# Altium schematic sheet 02 INPUT_PWR_2.SchDoc
size 420 x 297 mm; Address1: Address1; Address2: Address2; Address3: Address3; Address4: Address4; DocumentNumber: АБВГ.123456.001 Э3; SheetNumber: 2; SheetTotal: 23; Scale: 1:1; DocumentType: Схема электрическая принципиальная; FirstReferrence: АБВГ.123456.001
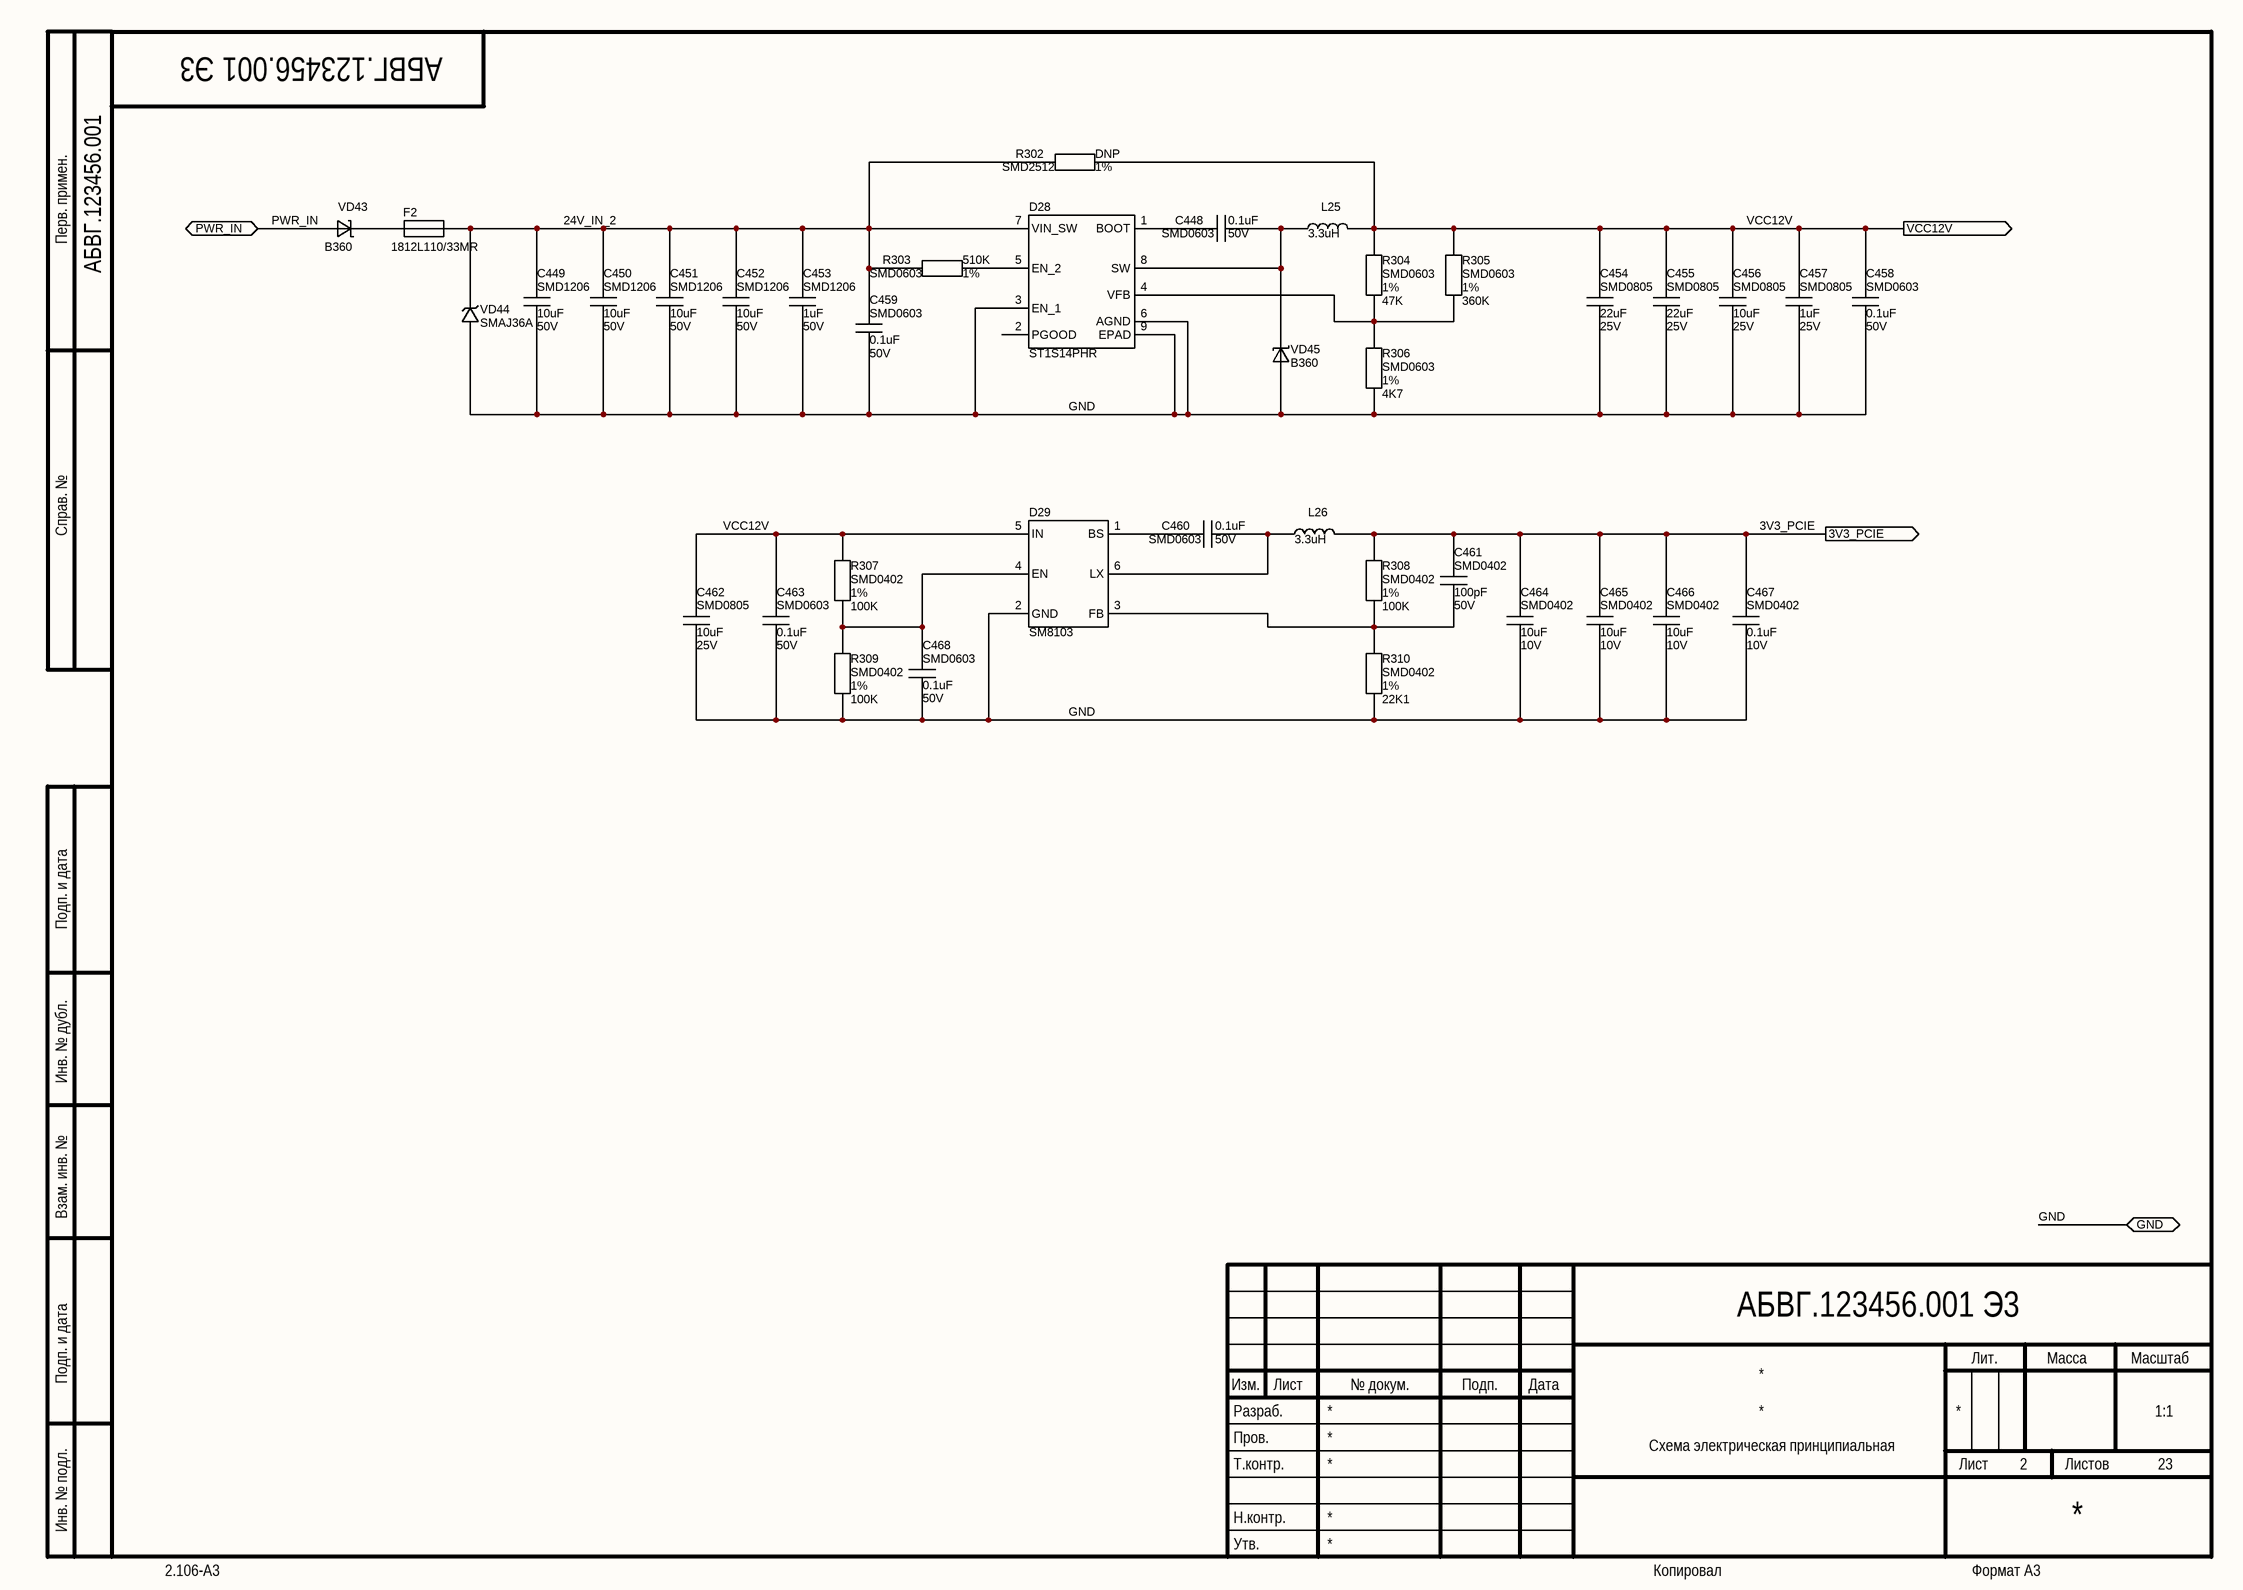
[diagram p0: 02 INPUT_PWR_2.SchDoc]

## Parts
C448  Package: SMD0603  Voltage: 50V  [CAP_SMD_0603]  (hidden comment: 0.1uF)
C449  Package: SMD1206  Voltage: 50V  [CAP_SMD_1206]  (hidden comment: 10uF)
C450  Package: SMD1206  Voltage: 50V  [CAP_SMD_1206]  (hidden comment: 10uF)
C451  Package: SMD1206  Voltage: 50V  [CAP_SMD_1206]  (hidden comment: 10uF)
C452  Package: SMD1206  Voltage: 50V  [CAP_SMD_1206]  (hidden comment: 10uF)
C453  Package: SMD1206  Voltage: 50V  [CAP_SMD_1206]  (hidden comment: 1uF)
C454  Package: SMD0805  Voltage: 25V  [CAP_SMD_0805]  (hidden comment: 22uF)
C455  Package: SMD0805  Voltage: 25V  [CAP_SMD_0805]  (hidden comment: 22uF)
C456  Package: SMD0805  Voltage: 25V  [CAP_SMD_0805]  (hidden comment: 10uF)
C457  Package: SMD0805  Voltage: 25V  [CAP_SMD_0805]  (hidden comment: 1uF)
C458  Package: SMD0603  Voltage: 50V  [CAP_SMD_0603]  (hidden comment: 0.1uF)
C459  Package: SMD0603  Voltage: 50V  [CAP_SMD_0603]  (hidden comment: 0.1uF)
C460  Package: SMD0603  Voltage: 50V  [CAP_SMD_0603]  (hidden comment: 0.1uF)
C461  Package: SMD0402  Voltage: 50V  [CAP_SMD_0402]  (hidden comment: 100pF)
C462  Package: SMD0805  Voltage: 25V  [CAP_SMD_0805]  (hidden comment: 10uF)
C463  Package: SMD0603  Voltage: 50V  [CAP_SMD_0603]  (hidden comment: 0.1uF)
C464  Package: SMD0402  Voltage: 10V  [CAP_SMD_0402]  (hidden comment: 10uF)
C465  Package: SMD0402  Voltage: 10V  [CAP_SMD_0402]  (hidden comment: 10uF)
C466  Package: SMD0402  Voltage: 10V  [CAP_SMD_0402]  (hidden comment: 10uF)
C467  Package: SMD0402  Voltage: 10V  [CAP_SMD_0402]  (hidden comment: 0.1uF)
C468  Package: SMD0603  Voltage: 50V  [CAP_SMD_0603]  (hidden comment: 0.1uF)
D28  ST1S14PHR  [SO8_PWR]
D29  SM8103  [SOT23-6]
F2  value 1812L110/33MR  [FUSE_SMD_1812]  (hidden comment: Value)
L25  value 3.3uH  [IHLP2020]  (hidden comment: Value)
L26  value 3.3uH  [IHLP2020]  (hidden comment: Value)
R302  Package: SMD2512  Tolerance: 1%  [RES_SMD_2512]  (hidden comment: DNP)
R303  Package: SMD0603  Tolerance: 1%  [RES_SMD_0603]  (hidden comment: 510K)
R304  Package: SMD0603  Tolerance: 1%  [RES_SMD_0603]  (hidden comment: 47K)
R305  Package: SMD0603  Tolerance: 1%  [RES_SMD_0603]  (hidden comment: 360K)
R306  Package: SMD0603  Tolerance: 1%  [RES_SMD_0603]  (hidden comment: 4K7)
R307  Package: SMD0402  Tolerance: 1%  [RES_SMD_0402]  (hidden comment: 100K)
R308  Package: SMD0402  Tolerance: 1%  [RES_SMD_0402]  (hidden comment: 100K)
R309  Package: SMD0402  Tolerance: 1%  [RES_SMD_0402]  (hidden comment: 100K)
R310  Package: SMD0402  Tolerance: 1%  [RES_SMD_0402]  (hidden comment: 22K1)
VD43  value B360  [SMA]  (hidden comment: Value)
VD44  SMAJ36A  [SMA]
VD45  value B360  [SMA]  (hidden comment: Value)

## Ports
3V3_PCIE (out), GND (bidir), PWR_IN (bidir), VCC12V (out)

## Nets
3V3_PCIE: C461.1 C464.1 C465.1 C466.1 C467.1 L26.1 R308.2 ; port 3V3_PCIE
24V_IN_2: C449.2 C450.2 C451.2 C452.2 C453.2 C459.2 D28.7(VIN_SW) F2.2 R302.1 R303.1 VD44.2(C)
GND: C449.1 C450.1 C451.1 C452.1 C453.1 C454.1 C455.1 C456.1 C457.1 C458.1 C459.1 C462.1 C463.1 C464.2 C465.2 C466.2 C467.2 C468.1 D28.3(EN_1) D28.6(AGND) D28.9(EPAD) D29.2(GND) R306.1 R309.1 R310.1 VD44.1(A) VD45.1(A) ; port GND
PWR_IN: VD43.1(A) ; port PWR_IN
VCC12V: C454.2 C455.2 C456.2 C457.2 C458.2 C462.2 C463.2 D29.5(IN) L25.1 R302.2 R304.2 R305.2 R307.2 ; port VCC12V
NetC448_1: C448.1 D28.8(SW) L25.2 VD45.2(C)
NetC448_2: C448.2 D28.1(BOOT)
NetC460_1: C460.1 D29.6(LX) L26.2
NetC460_2: C460.2 D29.1(BS)
NetC461_2: C461.2 D29.3(FB) R308.1 R310.2
NetC468_2: C468.2 D29.4(EN) R307.1 R309.2
NetD28_4: D28.4(VFB) R304.1 R305.1 R306.2
NetD28_5: D28.5(EN_2) R303.2
NetF2_1: F2.1 VD43.2(C)

Not connected (* = marked no-connect by the designer): D28 2(PGOOD)

## Notes on the sheet
- Перв. примен.
- Справ. №
- Подп. и дата
- Инв. № дубл.
- Взам. инв. №
- Разраб.
- Изм.
- Лист
- № докум.
- Подп.
- Дата
- Лит.
- Масса
- Масштаб
- Пров.
- Т.контр.
- Листов
- Инв. № подл.
- Утв.
- Н.контр.
- 2.106-A3
- Копировал
- Формат А3

## Library data of the parts
C448 C458-C460 C463 C468 = Ceramic_Cap: PartNumber: CC0603KRX7R9BB104; ComponentType: SMD Ceramic Chip Capacitor; Manufacter: *; Tolerance: *; ClassName: *; Value: 0.1uF
C449-C452 = Ceramic_Cap: PartNumber: CL31B106KBHNNNE; ComponentType: SMD Ceramic Chip Capacitor; Manufacter: *; Tolerance: *; ClassName: *; Value: 10uF
C453 = Ceramic_Cap: PartNumber: CC1206MRY5V9BB105; ComponentType: SMD Ceramic Chip Capacitor; Manufacter: *; Tolerance: *; ClassName: *; Value: 1uF
C454 C455 = Ceramic_Cap: PartNumber: CC0805MKX5R8BB226; ComponentType: SMD Ceramic Chip Capacitor; Manufacter: *; Tolerance: *; ClassName: *; Value: 22uF
C456 C462 = Ceramic_Cap: PartNumber: CL21A106KAYNNNE; ComponentType: SMD Ceramic Chip Capacitor; Manufacter: *; Tolerance: *; ClassName: *; Value: 10uF
C457 = Ceramic_Cap: PartNumber: CC0805KKX7R8BB105; ComponentType: SMD Ceramic Chip Capacitor; Manufacter: *; Tolerance: *; ClassName: *; Value: 1uF
C461 = Ceramic_Cap: PartNumber: CC0402KRNPO9BN101; ComponentType: SMD Ceramic Chip Capacitor; Manufacter: *; Tolerance: *; ClassName: *; Value: 100pF
C464-C466 = Ceramic_Cap: PartNumber: CC0402MRX5R6BB106; ComponentType: SMD Ceramic Chip Capacitor; Manufacter: *; Tolerance: *; ClassName: *; Value: 10uF
C467 = Ceramic_Cap: PartNumber: CC0402KRX5R6BB104; ComponentType: SMD Ceramic Chip Capacitor; Manufacter: *; Tolerance: *; ClassName: *; Value: 0.1uF
D28 = ST1S14: Manufacter: ST; ComponentType: step-down switching regulator; Package: Power SO8; PartNumber: ST1S14PHR; ClassName: *; Value: ST1S14PHR
D29 = SM8103: Manufacter: ST; ComponentType: step-down switching regulator; Package: TSOT23-6; PartNumber: SM8103; ClassName: *; Value: SM8103
F2 = Fuse: ComponentType: *; Manufacter: *; Package: SMD1812; PartNumber: 1812L110/33MR; ClassName: *
L25 L26 = Inductor_smal: PartNumber: IHLP2020CZER3R3M01; ComponentType: *; Manufacter: *; Package: IHLP2020; ClassName: *
R302 = Chip_Res: PartNumber: RC2512FK-070RL; ComponentType: SMD Chip Resistor; Manufacter: *; Voltage: *; ClassName: *; Value: DNP
R303 = Chip_Res: PartNumber: RC0603FR-07510KL; ComponentType: SMD Chip Resistor; Manufacter: *; Voltage: *; ClassName: *; Value: 510K
R304 = Chip_Res: PartNumber: RC0603FR-0747KL; ComponentType: SMD Chip Resistor; Manufacter: *; Voltage: *; ClassName: *; Value: 47K
R305 = Chip_Res: PartNumber: RC0603FR-07360KL; ComponentType: SMD Chip Resistor; Manufacter: *; Voltage: *; ClassName: *; Value: 360K
R306 = Chip_Res: PartNumber: RC0603FR-074K7L; ComponentType: SMD Chip Resistor; Manufacter: *; Voltage: *; ClassName: *; Value: 4K7
R307-R309 = Chip_Res: PartNumber: RC0402FR-07100KL; ComponentType: SMD Chip Resistor; Manufacter: *; Voltage: *; ClassName: *; Value: 100K
R310 = Chip_Res: PartNumber: RC0402FR-0722K1L; ComponentType: SMD Chip Resistor; Manufacter: *; Voltage: *; ClassName: *; Value: 22K1
VD43 VD45 = ShottkyDiode: ComponentType: *; Manufacter: *; Package: SMA; PartNumber: B360; ClassName: *
VD44 = ZenerDiode: ComponentType: *; Manufacter: *; Package: SMA; PartNumber: SMAJ36A; ClassName: *; Value: SMAJ36A